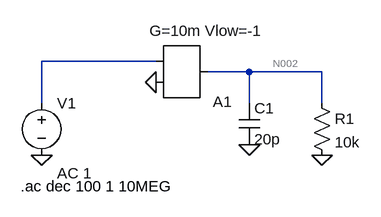
[diagram p0: schematic TP1-10.asc]
TP1-10.asc, the LTspice schematic file:
Version 4
SHEET 1 880 680
WIRE 160 128 -16 128
WIRE 304 144 240 144
WIRE 416 144 304 144
WIRE -16 192 -16 128
WIRE 304 192 304 144
WIRE 416 192 416 144
FLAG -16 272 0
FLAG 304 256 0
FLAG 416 272 0
FLAG 160 160 0
SYMBOL SpecialFunctions\\ota 192 208 M180
WINDOW 3 -42 127 Left 2
SYMATTR Value G=10m Vlow=-1
SYMATTR InstName A1
SYMBOL cap 288 192 R0
SYMATTR InstName C1
SYMATTR Value 20p
SYMBOL res 400 176 R0
SYMATTR InstName R1
SYMATTR Value 10k
SYMBOL voltage -16 176 R0
WINDOW 123 24 124 Left 2
WINDOW 39 0 0 Left 0
SYMATTR Value2 AC 1
SYMATTR InstName V1
SYMATTR Value ""
TEXT -48 320 Left 2 !.ac dec 100 1 10MEG

The netlist it stands for:
* TP1-10.asc
A1 0 N001 0 0 0 0 N002 0 OTA G=10m Vlow=-1
C1 N002 0 20p
R1 N002 0 10k
V1 N001 0 AC 1
.ac dec 100 1 10MEG
.backanno
.end

* Results of the author's LTspice run, read from the files saved beside the schematic
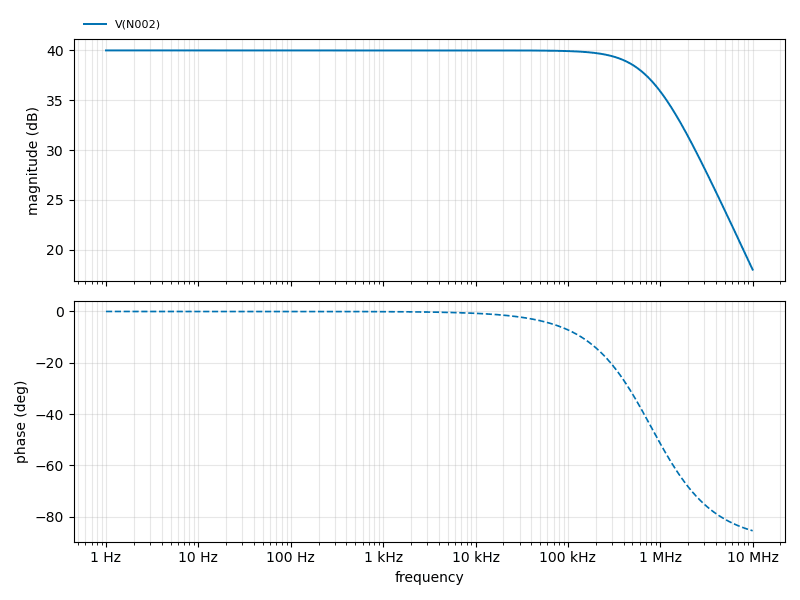
[diagram p1: AC Analysis of TP1-10.asc, plotted from the saved traces]
* AC Analysis, 1 run:
*   V(N002): 40.00 dB at 1 Hz, 17.99 dB at 10 MHz, peak 40.00 dB at 1 Hz, 3 dB below the peak at 795.8 kHz